# EAGLE design touch-switch-controller (EAGLE 6.4)
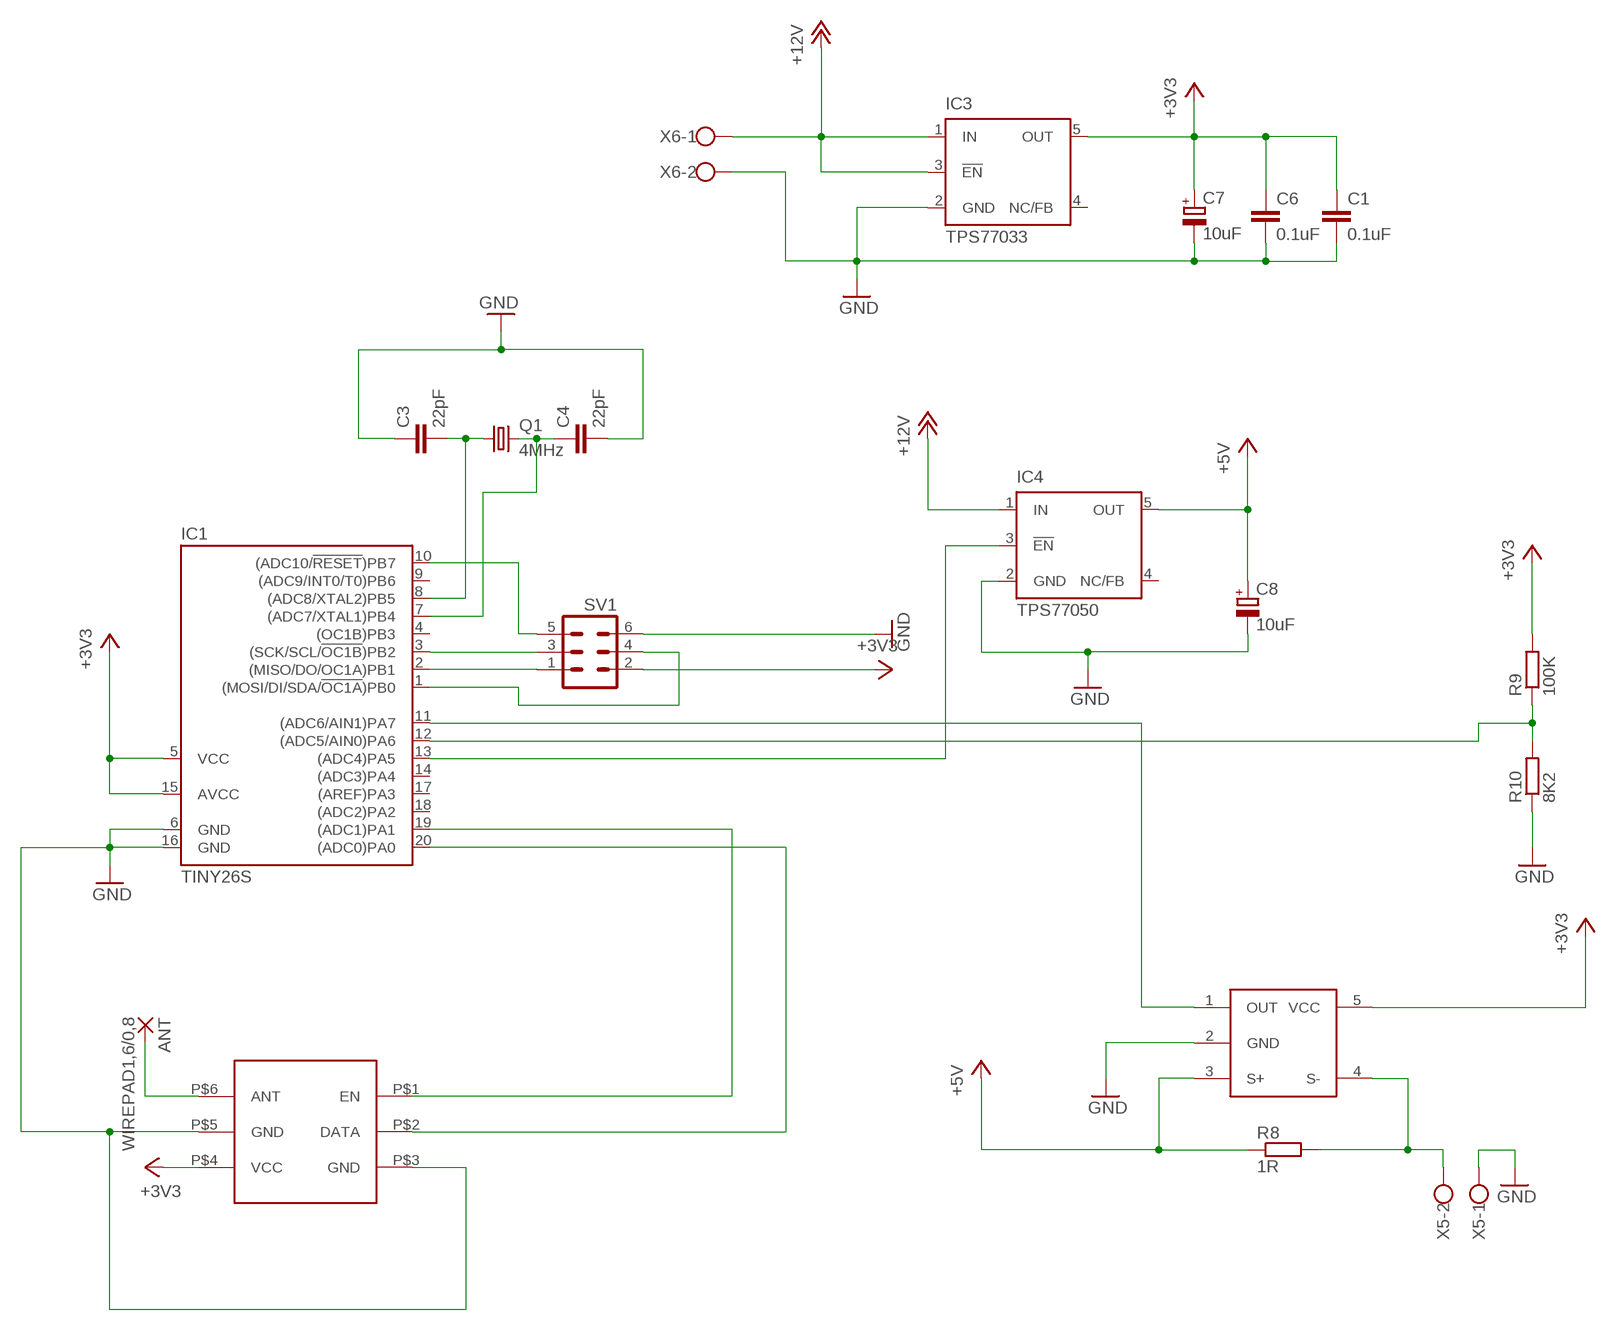
[diagram p0: schematic, sheet 1]

## Parts
ANT  WIREPAD1,6/0,8  [1,6/0,8]
C1  0.1uF  C-EUC0603  [C0603]
C3  22pF  C-EUC0603  [C0603]
C4  22pF  C-EUC0603  [C0603]
C6  0.1uF  C-EUC0603  [C0603]
C7  10uF  CPOL-EUSMCB  [SMC_B]
C8  10uF  CPOL-EUSMCB  [SMC_B]
IC1  TINY26S  [SO20L]
IC3  TPS77033  [SOT23-DBV]
IC4  TPS77050  [SOT23-DBV]
Q1  4MHz  CRYSTALHC49UP  [HC49UP]
R8  1R  R-EU_R0603  [R0603]
R9  100K  R-EU_R0603  [R0603]
R10  8K2  R-EU_R0603  [R0603]
SV1  MA03-2  [MA03-2]
U$1  ZXCT1086  [SOT23-5L]
U$2  RTFQ1  [RTFQ1]
X5  W237-102  [W237-102]
X6  W237-102  [W237-102]

## Nets
+3V3: C1.1 C6.1 C7.+ IC1.5(VCC) IC1.15(AVCC) IC3.5(OUT) R9.2 SV1.2 U$1.5(VCC) U$2.P$4(VCC)
+5V: C8.+ IC4.5(OUT) R8.1 U$1.3(S+)
+12V: IC3.1(IN) IC3.3(!EN) IC4.1(IN) X6.1
GND: C1.2 C3.1 C4.2 C6.2 C7.- C8.- IC1.6(GND) IC1.16(GND) IC3.2(GND) IC4.2(GND) R10.1 SV1.6 U$1.2(GND) U$2.P$3(GND) U$2.P$5(GND) X5.1 X6.2
N$1: IC1.12((ADC5/AIN0)PA6) R9.1 R10.2
N$3: IC1.19((ADC1)PA1) U$2.P$1(EN)
N$4: ANT.1(P) U$2.P$6(ANT)
N$7: IC1.13((ADC4)PA5) IC4.3(!EN)
N$8: IC1.2((MISO/DO/OC1A)PB1) SV1.1
N$9: IC1.3((SCK/SCL/!OC1B!)PB2) SV1.3
N$10: IC1.10((ADC10/!RESET!)PB7) SV1.5
N$11: IC1.1((MOSI/DI/SDA/!OC1A!)PB0) SV1.4
N$12: IC1.20((ADC0)PA0) U$2.P$2(DATA)
N$29: R8.2 U$1.4(S-) X5.2
N$31: IC1.11((ADC6/AIN1)PA7) U$1.1(OUT)
N$32: C3.2 IC1.8((ADC8/XTAL2)PB5) Q1.1
N$33: C4.1 IC1.7((ADC7/XTAL1)PB4) Q1.2
Unconnected: IC1.4((OC1B)PB3) IC1.9((ADC9/INT0/T0)PB6) IC1.14((ADC3)PA4) IC1.17((AREF)PA3) IC1.18((ADC2)PA2) IC3.4(NC/FB) IC4.4(NC/FB)

## Library data of the parts
ANT = wirepad:WIREPAD: Wire PAD connect wire on PCB
C1 C3 C4 C6 = resistor:C-EU: CAPACITOR, European symbol
C7 C8 = resistor:CPOL-EU: POLARIZED CAPACITOR, European symbol
IC1 = atmel:TINY26*: 8-bit AVR Microcontroller with 2K Bytes Flash Source: http://www.atmel.com .. doc1477.pdf; MPN: ATTINY261-20SU; OC_FARNELL: 1455147; OC_NEWARK: 58M3783
IC3 = texas:TPS770*: ULTRALOW-POWER 50-mA LOW-DROPOUT LINEAR REGULATORS 50-mA Low-Dropout Regulator Source: http://focus.ti.com/lit/ds/symlink/tps77001.pdf; MF: TEXAS INSTRUMENTS; MPN: TPS77033DBVT; OC_FARNELL: 8461570; OC_NEWARK: 77C1187
IC4 = texas:TPS770*: ULTRALOW-POWER 50-mA LOW-DROPOUT LINEAR REGULATORS 50-mA Low-Dropout Regulator Source: http://focus.ti.com/lit/ds/symlink/tps77001.pdf; MF: TEXAS INSTRUMENT CONNECTORS; MPN: TPS77050DBVT; OC_FARNELL: 1412883; OC_NEWARK: 77C1189
Q1 = crystal:CRYSTAL: CRYSTAL; OC_FARNELL: unknown; OC_NEWARK: unknown
R8-R10 = resistor:R-EU_: RESISTOR, European symbol
SV1 = con-lstb:MA03-2: PIN HEADER; OC_FARNELL: unknown; OC_NEWARK: unknown
U$1 = __SR:ZXCT1086
U$2 = __SR:RTFQ1
X5 X6 = con-wago-500:W237-102: WAGO SCREW CLAMP; MPN: 237-102; OC_FARNELL: unknown; OC_NEWARK: 70K9898

## Board
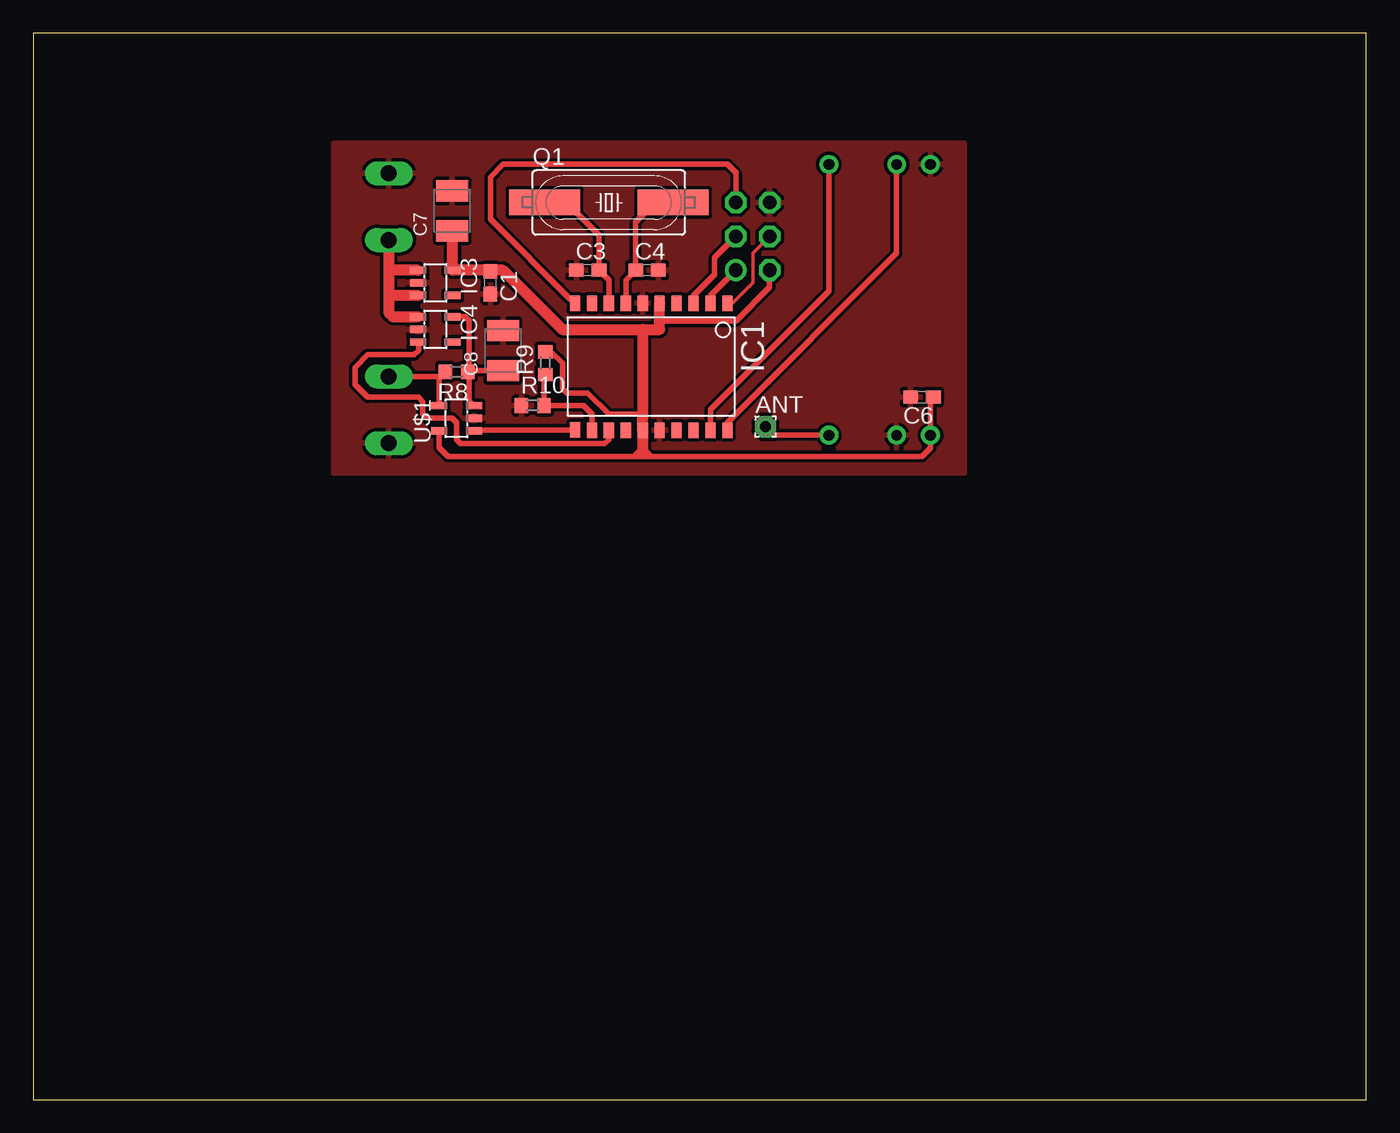
[diagram p1: board, top side]
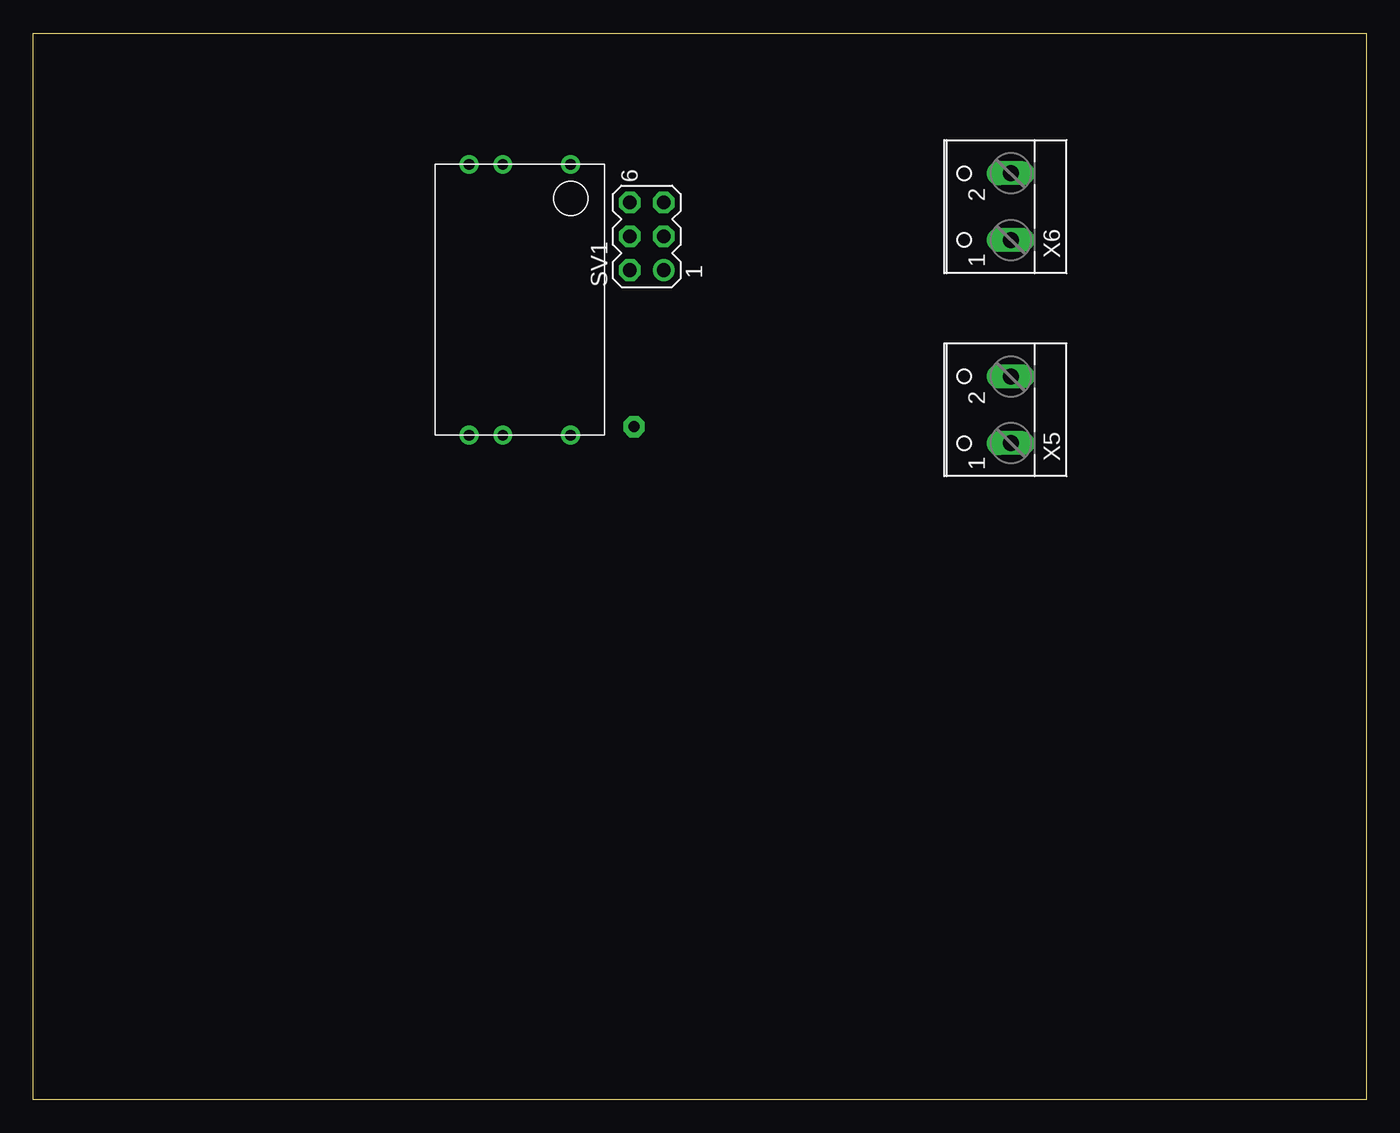
[diagram p2: board, bottom side, seen from below]

Size 100 x 80 mm. Coordinates in mm from the lower left corner, seen from the top.
Outline: 0,0 100,0 100,80 0,80 0,0
Copper layers (1*16): Top 0.035mm / dielectric 1.5mm / Bottom 0.035mm
Design rules "default *": minimum track width 10mil, minimum drill 24mil, track to track 8mil, track to pad 8mil, pad to pad 8mil, via to via 8mil, smd to smd 8mil, copper to edge 40mil, drill to drill 8mil, minimum pad ring 12mil, minimum via ring 8mil, stop-mask expansion 4mil, vias tented up to drill 0mil, thermal gap 10mil

### Footprints (pad centres in the part's own frame; a part is rotated, then mirrored left to right if it is on the bottom)
1,6/0,8 = drill 0.813 pad 1.6 octagon: 1 0,0
C0603 = smd 1.1 x 1: 1 -0.85,0; 2 0.85,0
SMC_B = smd 1.6 x 2.4: + -1.5,0; - 1.5,0
SO20L = smd 0.762 x 1.143: 1 -5.08,-5.131; 2 -3.81,-5.131; 3 -2.54,-5.131; 4 -1.27,-5.131; 5 0,-5.131; 6 1.27,-5.131; 7 2.54,-5.131; 8 3.81,-5.131; 9 5.08,-5.131; 10 6.35,-5.131; 11 6.35,4.369; 12 5.08,4.394; 13 3.81,4.394; 14 2.54,4.394; 15 1.27,4.394; 16 0,4.394; 17 -1.27,4.394; 18 -2.54,4.394; 19 -3.81,4.394; 20 -5.08,4.394
SOT23-DBV = smd 0.55 x 1.2: 1 -0.95,-1.3; 2 0,-1.3; 3 0.95,-1.3; 4 0.95,1.3; 5 -0.95,1.3
HC49UP = smd 5.334 x 1.93: 1 -4.826,0; 2 4.826,0
R0603 = smd 1 x 1.1: 1 -0.85,0; 2 0.85,0
MA03-2 = drill 1.016: 1 -2.54,-1.27 | drill 1.016 octagon: 2 -2.54,1.27; 3 0,-1.27; 4 0,1.27; 5 2.54,-1.27; 6 2.54,1.27
SOT23-5L = smd 0.55 x 1.2: 1 -0.95,-1.3; 2 0,-1.3; 3 0.95,-1.3; 4 0.95,1.3; 5 -0.95,1.3
RTFQ1 = drill 0.8: P$1 -10.16,3.81; P$2 -10.16,-1.27; P$3 -10.16,-3.81; P$4 10.16,-3.81; P$5 10.16,-1.27; P$6 10.16,3.81
W237-102 = drill 1.194 long: 1 -2.5,-1.27; 2 2.5,-1.27

### Placement (x,y rotation side)
ANT  54.93,50.48 0 top
C1  34.29,61.28 270 top
C3  41.59,62.23 0 top
C4  46.04,62.23 0 top
C6  66.67,52.7 180 top
C7  31.43,66.67 90 top
C8  35.24,56.2 90 top
IC1  46.99,54.61 180 top
IC3  30.16,61.28 270 top
IC4  30.16,57.78 270 top
Q1  43.18,67.31 0 top
R8  31.75,54.61 180 top
R9  38.42,55.24 90 top
R10  37.47,52.07 0 top
SV1  53.98,64.77 90 bottom
U$1  31.75,51.12 90 top
U$2  63.5,60.01 270 bottom
X5  27.94,51.75 90 bottom
X6  27.94,66.99 90 bottom

### Tracks (layer width: path | path; a pad name or v marks a point on that pad's centre or on a via)
+3V3
  Top 0.406: U$1.5 30.45,48.92 31.11,48.26 45.09,48.26 | 45.72,51.12 45.72,51.44 43.18,51.44 41.59,53.02 40.01,53.02 39.69,53.34 39.69,55.24 38.84,56.09 R9.2 | 46.35,48.26 66.67,48.26 67.31,48.9 U$2.P$4 67.31,53.02 C6.1 | 46.35,48.26 45.72,48.26 | 45.72,48.26 45.09,48.26 | 46.99,58.42 52.7,58.42 55.24,60.96 SV1.2 | C1.1 34.61,62.13 34.61,62.23 | 45.72,48.9 45.72,48.26 | 45.09,48.26 45.72,48.9 | 45.72,48.9 46.35,48.26
  Top 0.813: 45.72,57.78 39.69,57.78 35.24,62.23 34.61,62.23 IC3.5 31.46,65.14 C7.+ | 45.72,57.78 45.72,51.12 IC1.15 45.72,48.9 | 45.72,57.78 46.99,57.78 46.99,58.42 IC1.5
+5V
  Top 0.406: 33.02,52.1 U$1.3 32.7,52.41 32.7,54.51 R8.1 32.69,54.7 | C8.+ 32.69,54.7 | 32.69,54.7 32.69,58.44 32.38,58.74 IC4.5
+12V
  Top 0.813: X6.1 26.67,62.23 | 26.67,62.23 26.67,60.33 | 26.67,60.33 26.67,59.05 26.99,58.74 IC4.1 | IC3.3 26.67,60.33 | IC3.1 26.67,62.23
GND
  pour Top (isolate 0.254): 22.54,71.75 69.85,71.75 69.85,46.99 22.54,46.99
N$1
  Top 0.406: IC1.12 41.91,51.44 41.27,52.07 R10.2 38.31,54.29 R9.1
N$3
  Top 0.406: IC1.19 50.8,51.75 59.69,60.64 U$2.P$1
N$4
  Top 0.406: U$2.P$6 55.56,49.85 ANT.1
N$7
  Top 0.406: IC1.13 43.18,49.53 42.86,49.21 32.07,49.21 31.75,49.53 31.75,50.8 31.43,51.12 29.53,51.12 29.21,51.44 29.21,52.39 28.89,52.7 25.08,52.7 24.13,53.66 24.13,54.93 25.08,55.88 28.57,55.88 28.89,56.2 28.89,56.8 IC4.3
N$8
  Top 0.406: IC1.2 50.8,60.33 SV1.1
N$9
  Top 0.406: IC1.3 49.53,60.33 51.12,61.91 51.12,63.18 SV1.3
N$10
  Top 0.406: SV1.5 52.7,69.53 52.07,70.17 35.24,70.17 34.29,69.22 34.29,66.04 40.27,60.06 40.32,60.06 IC1.10
N$11
  Top 0.254: SV1.4 53.98,63.5 53.98,61.28 52.44,59.74 IC1.1
N$12
  Top 0.406: U$2.P$2 64.77,63.5 52.07,50.8 IC1.20
N$29
  Top 0.406: U$1.4 30.45,54.16 | 30.45,54.16 R8.2 | X5.2 30.36,54.25 30.45,54.16
N$31
  Top 0.406: IC1.11 33.93,50.24 U$1.1
N$32
  Top 0.406: IC1.8 43.18,61.49 C3.2 42.44,64.87 40.64,66.67 38.67,66.67 Q1.1
N$33
  Top 0.406: IC1.7 44.45,61.49 C4.1 45.19,65.83 46.35,66.99 Q1.2